# EAGLE design rapidshark-main-breakout-top-mk-1.C (EAGLE 7.5.0)
AUTHOR: sean@yak.net
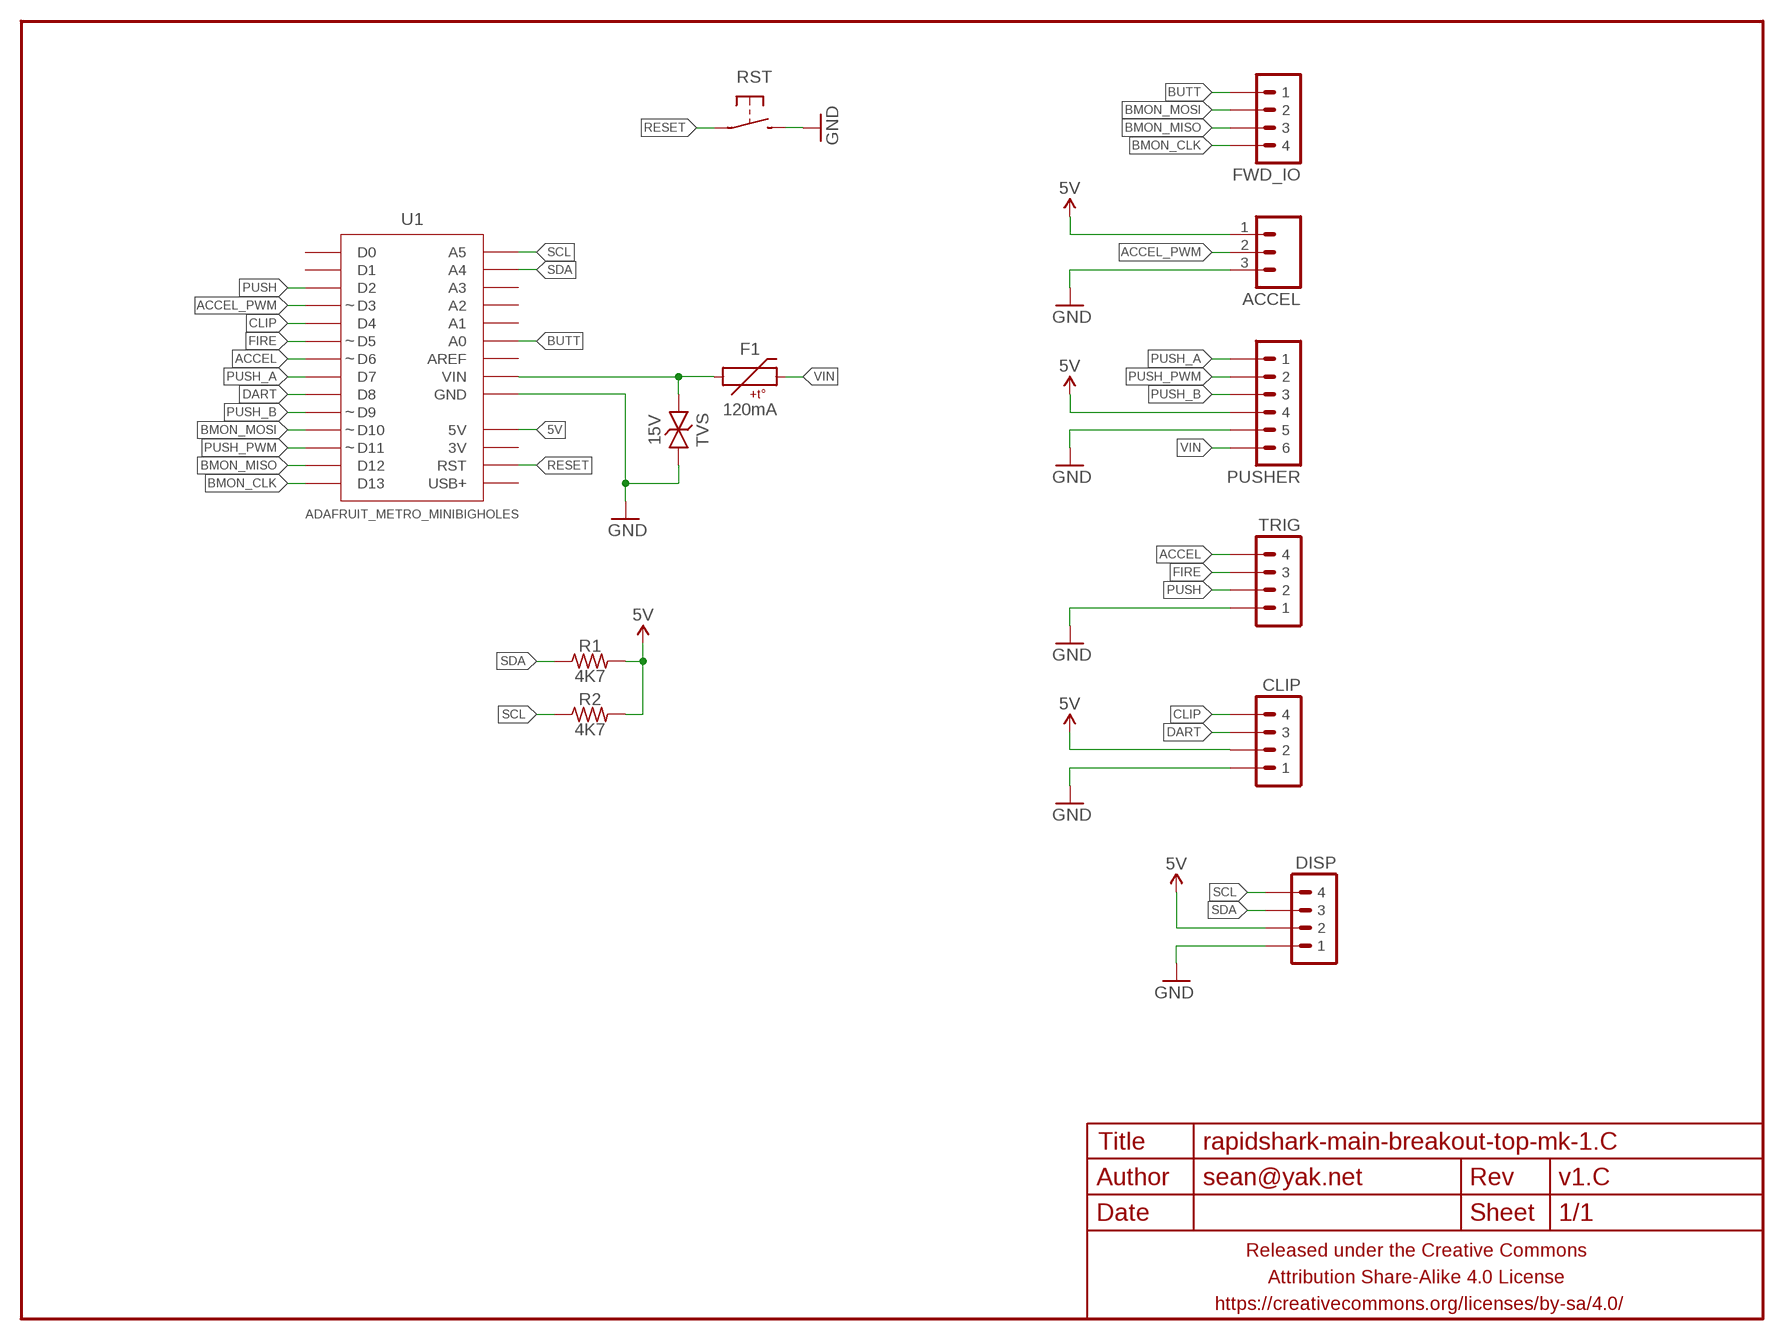
[diagram p0: schematic, sheet 1]

## Parts
ACCEL  M03JST-PTH-VERT-CENTERED  [JST-3-PH-VERT-PTH-CENTERED]
CLIP  M04JST-PTH-VERT  [JST-4-PH-VERT-PTH]
DISP  M04JST-PTH-VERT  [JST-4-PH-VERT-PTH]
F1  120mA  PTCSMD  [PTC-1206]
FRAME1  FRAME-LETTERNO_PACKAGE  [DUMMY]
FWD_IO  M04JST-PTH-VERT  [JST-4-PH-VERT-PTH]
PUSHER  M06JST-PH-PTH-VERT  [JST-6-PH-VERT-PTH]
R1  4K7  RESISTORR0603-TIGHTER  [R0603-TIGHTER]
R2  4K7  RESISTORR0603-TIGHTER  [R0603-TIGHTER]
RST  SPST-NO-TACTCK-PTS840-GK  [TACTILE-SMD-CK-PTS840-GK]
TRIG  M04JST-PTH-VERT  [JST-4-PH-VERT-PTH]
TVS  15V  TVSSMA  [SMA-DIODE-TVS-BIDIR]
U1  ADAFRUIT_METRO_MINIBIGHOLES  [ADAFRUIT_METRO_MINI_BIGHOLES]

## Nets
5V: ACCEL.1 CLIP.2 DISP.2 PUSHER.4 R1.2 R2.2 U1.18(5V)
ACCEL: TRIG.4 U1.7(D6)
ACCEL_PWM: ACCEL.2 U1.4(D3)
BMON_CLK: FWD_IO.4 U1.14(D13)
BMON_MISO: FWD_IO.3 U1.13(D12)
BMON_MOSI: FWD_IO.2 U1.11(D10)
BUTT: FWD_IO.1 U1.23(A0)
CLIP: CLIP.4 U1.5(D4)
DART: CLIP.3 U1.9(D8)
FIRE: TRIG.3 U1.6(D5)
GND: ACCEL.3 CLIP.1 DISP.1 PUSHER.5 RST.3 RST.4 TRIG.1 TVS.1 U1.19(GND) U1.20(GND)
N$1: F1.1 TVS.2 U1.21(VIN)
PUSH: TRIG.2 U1.3(D2)
PUSH_A: PUSHER.1 U1.8(D7)
PUSH_B: PUSHER.3 U1.10(D9)
PUSH_PWM: PUSHER.2 U1.12(D11)
RESET: RST.1 RST.2 U1.16(RST)
SCL: DISP.4 R2.1 U1.28(A5)
SDA: DISP.3 R1.1 U1.27(A4)
VIN: F1.2 PUSHER.6
Unconnected: U1.1(D0) U1.2(D1) U1.15(USB+) U1.17(3V) U1.22(AREF) U1.24(A1) U1.25(A2) U1.26(A3)

## Library data of the parts
ACCEL = a_parts:M03: Header 3 Standard 3-pin 0.1" header. Use with straight break away headers (SKU : PRT-00116), right angle break away headers (PRT-00553), swiss pins (PRT-00743), machine pins (PRT-00117), and female headers (PRT-00115). Molex polarized connector foot print use with SKU : PRT-08232 with associated crimp pins and housings.
CLIP DISP FWD_IO TRIG = a_parts:M04: Header 4 Standard 4-pin 0.1" header. Use with straight break away headers (SKU : PRT-00116), right angle break away headers (PRT-00553), swiss pins (PRT-00743), machine pins (PRT-00117), and female headers (PRT-00115). Molex polarized connector foot print use with SKU : PRT-08231 with associated crimp pins and housings. 1MM SMD Version SKU: PRT-10208
F1 = a_parts:PTC: Resettable Fuse PTC Resettable Fuse. Spark Fun Electronics SKU : COM-08357; PROD_ID: RES-11150
FRAME1 = a_parts:FRAME-LETTER: Schematic Frame Standard 8.5x11 US Letter frame; DESIGNER: sean@yak.net; VERSION: v1.C
PUSHER = a_parts:M06: Header 6 Standard 6-pin 0.1" header. Use with straight break away headers (SKU : PRT-00116), right angle break away headers (PRT-00553), swiss pins (PRT-00743), machine pins (PRT-00117), and female headers (PRT-00115). Molex polarized connector foot print use with SKU : PRT-08094 with associated crimp pins and housings. NOTES ON THE VARIANTS LOCK and LOCK_LONGPADS... This footprint was designed to help hold the alignment of a through-hole component (i.e. 6-pin header) while soldering it into place. You may notice that each hole has been shifted either up or down by 0.005 of an inch from it's more standard position (which is a perfectly straight line). This slight alteration caused the pins (the squares in the middle) to touch the edges of the holes. Because they are alternating, it causes a "brace" to hold the component in place. 0.005 has proven to be the perfect amount of "off-center" position when using our standard breakaway headers. Although looks a little odd when you look at the bare footprint, once you have a header in there, the alteration is very hard to notice. Also,if you push a header all the way into place, it is covered up entirely on the bottom side. This idea of altering the position of holes to aid alignment will be further integrated into the Sparkfun Library for other footprints. It can help hold any component with 3 or more connection pins.
R1 R2 = a_parts:RESISTOR: RESISTOR, American symbol
RST = a_parts:SPST-NO-TACT
TVS = a_parts:TVS: Transient voltage suppressor- prevents ESD on inputs. Ignore package description- MBRA140 is NOT this type of part!!!
U1 = a_parts:ADAFRUIT_METRO_MINI

## Board
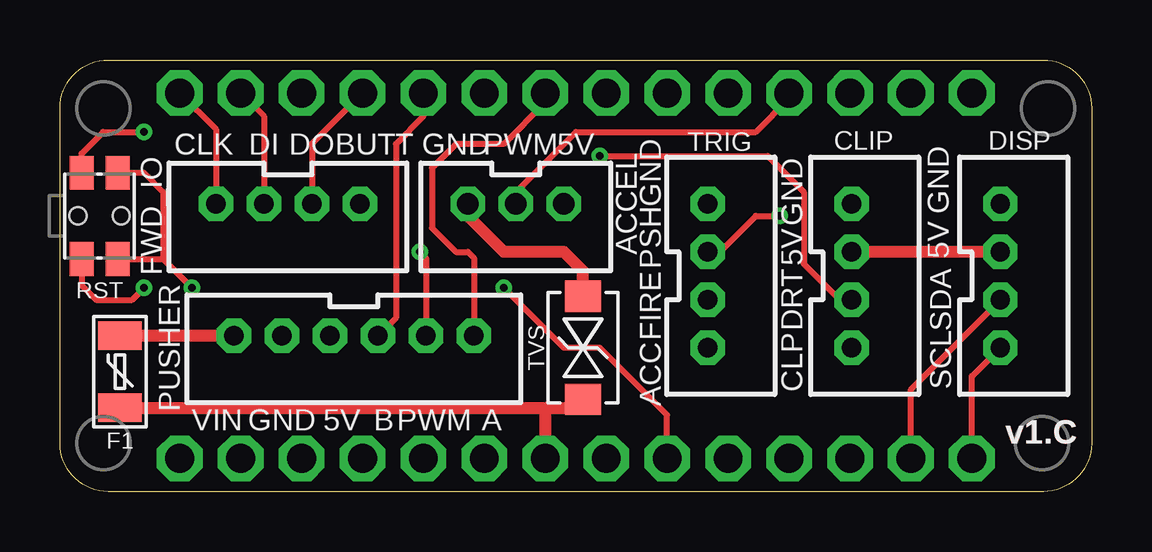
[diagram p1: board, top side]
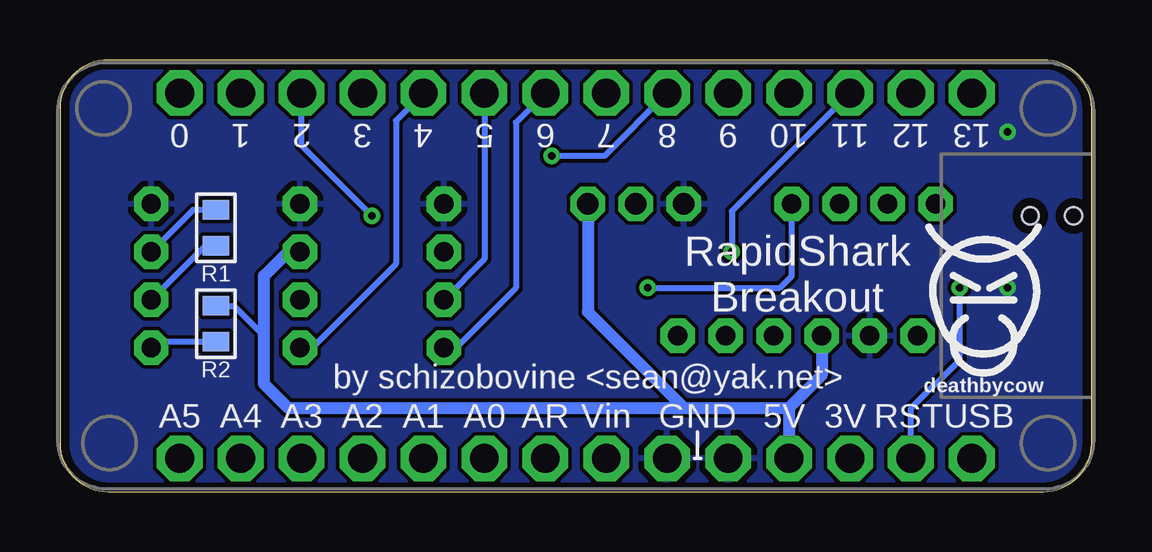
[diagram p2: board, bottom side, seen from below]

Size 43 x 18 mm. Coordinates in mm from the lower left corner, seen from the top.
Outline: 2,18 41,18 arc-90 43,16 43,2 arc-90 41,0 2,0 arc-90 0,2 0,16 arc-90 2,18
Copper layers (1*16): Top 0.0356mm / dielectric 1.5011mm / Bottom 0.0356mm
Design rules "LaenPCBOrder_2": minimum track width 6mil, minimum drill 13mil, track to track 6mil, track to pad 6mil, pad to pad 6mil, via to via 6mil, smd to smd 6mil, copper to edge 15mil, drill to drill 6mil, minimum pad ring 7mil, minimum via ring 7mil, stop-mask expansion 3mil, vias tented up to drill 20mil, thermal gap 10mil

### Footprints (pad centres in the part's own frame; a part is rotated, then mirrored left to right if it is on the bottom)
JST-3-PH-VERT-PTH-CENTERED = drill 0.9 pad 1.422 octagon: 1 -2,0; 2 0,0; 3 2,0
JST-4-PH-VERT-PTH = drill 0.8 pad 1.422 octagon: 1 0,0; 2 2,0; 3 4,0; 4 6,0
PTC-1206 = smd 1.2 x 1.8: 1 -1.5,0; 2 1.5,0
JST-6-PH-VERT-PTH = drill 0.8 pad 1.422 octagon: 1 -5,0; 2 -3,0; 3 -1,0; 4 1,0; 5 3,0; 6 5,0
R0603-TIGHTER = smd 0.8 x 1.1: 1 -0.75,0; 2 0.75,0
TACTILE-SMD-CK-PTS840-GK = smd 1.4 x 1: 1 -1.8,0.75; 2 1.8,0.75; 3 -1.8,-0.75; 4 1.8,-0.75 | hole 0.7: 0,-0.9; 0,0.9
SMA-DIODE-TVS-BIDIR = smd 1.3 x 1.5: 1 -2.15,0; 2 2.15,0
ADAFRUIT_METRO_MINI_BIGHOLES = drill 1.2 pad 1.9 octagon: 1 16.51,7.62; 2 13.97,7.62; 3 11.43,7.62; 4 8.89,7.62; 5 6.35,7.62; 6 3.81,7.62; 7 1.27,7.62; 8 -1.27,7.62; 9 -3.81,7.62; 10 -6.35,7.62; 11 -8.89,7.62; 12 -11.43,7.62; 13 -13.97,7.62; 14 -16.51,7.62; 15 -16.51,-7.62; 16 -13.97,-7.62; 17 -11.43,-7.62; 18 -8.89,-7.62; 19 -6.35,-7.62; 20 -3.81,-7.62; 21 -1.27,-7.62; 22 1.27,-7.62; 23 3.81,-7.62; 24 6.35,-7.62; 25 8.89,-7.62; 26 11.43,-7.62; 27 13.97,-7.62; 28 16.51,-7.62

### Placement (x,y rotation side)
ACCEL  19,12 180 top
CLIP  33,12 270 top
DISP  39.2,12 270 top
F1  2.5,5 90 top
FRAME1  0,0 270 bottom
FWD_IO  12.5,12 180 top
PUSHER  12.25,6.5 180 top
R1  36.5,11 90 bottom
R2  36.5,7 90 bottom
RST  1.65,11.5 270 top
TRIG  27,12 270 top
TVS  21.8,6 270 top
U1  21.5,9 0 top
U$2  [COW_SMALL]  4.5,8.5 0 bottom

### Tracks (layer width: path | path; a pad name or v marks a point on that pad's centre or on a via)
5V
  Top 0.5: DISP.2 CLIP.2
  Bottom 0.254: R1.2 37.45,11.75 DISP.2 | R2.2 35.75,7.75 34.5,6.5
  Bottom 0.5: 17,3.5 33.5,3.5 34.5,4.5 34.5,6.5 34.5,9 33.5,10 CLIP.2 | 17,3.5 12.61,3.5 | 12.61,3.5 U1.18 | PUSHER.4 11.25,4.86 12.61,3.5 | ACCEL.1 21,7.5 17,3.5
ACCEL
  Bottom 0.254: U1.7 24,15.39 24,8.5 26.5,6 TRIG.4
ACCEL_PWM
  Top 0.254: ACCEL.2 19,12.5 21.5,15 29,15 30.39,16.39 U1.4
BMON_CLK
  Top 0.254: U1.14 6.5,15.11 FWD_IO.4
BMON_MISO
  Top 0.254: U1.13 8.5,15.65 FWD_IO.3
BMON_MOSI
  Top 0.254: U1.11 10.5,14.51 FWD_IO.2
BUTT  (via drill 0.33)
  Top 0.254: U1.23 25.31,3.19 22.5,6 21,6 v18.5,8.5
  Bottom 0.254: v18.5,8.5 13,8.5 12.5,9 FWD_IO.1
CLIP
  Bottom 0.254: U1.5 29,15.47 29,9.5 32.5,6 CLIP.4
DART  (via drill 0.33)
  Top 0.254: v22.5,14 29.5,14 31,12.5 31,9.5 32.5,8 CLIP.3
  Bottom 0.254: U1.9 20.31,14 v22.5,14
FIRE
  Bottom 0.254: U1.6 25.31,9.69 TRIG.3
GND  (via drill 0.33)
  Top 0.254: RST.3 0.9,14.1 1.8,15 v3.5,15 | RST.4 0.9,8.6 1.5,8 3,8 v3.5,8.5
  Top 0.5: ACCEL.3 17,11.5 18.5,10 21,10 21.8,9.2 TVS.1
  pour Bottom (rank 6): 2,18 41,18 arc-90 43,16 43,2 arc-90 41,0 2,0 arc-90 0,2 0,16 arc-90
N$1
  Top 0.5: F1.1 20.3,3.5 | 20.3,3.5 21.45,3.5 TVS.2 | U1.21 20.23,3.43 20.3,3.5
PUSH  (via drill 0.33)
  Top 0.254: TRIG.2 27.5,10 29,11.5 v30,11.5
  Bottom 0.254: v30,11.5 32.93,14.43 U1.3
PUSH_A
  Top 0.254: U1.8 20.23,16.23 18.5,14.5 16.5,14.5 15.5,13.5 15.5,11 16.5,10 17,10 17.25,9.75 PUSHER.1
PUSH_B
  Top 0.254: U1.10 15.15,15.65 14,14.5 14,7.25 PUSHER.3
PUSH_PWM  (via drill 0.33)
  Top 0.254: v15,10 15.25,9.75 PUSHER.2
  Bottom 0.254: U1.12 15,11.69 v15,10
RESET  (via drill 0.33)
  Top 0.254: 4.3,9.7 v5.5,8.5 | RST.2 4.3,9.7 | RST.1 3.5,13.3 4.3,12.5 4.3,9.7
  Bottom 0.254: U1.16 7.53,3.47 5.5,5.5 v5.5,8.5
SCL
  Top 0.254: U1.28 38.01,4.81 DISP.4
  Bottom 0.254: R2.1 38.95,6.25 DISP.4
SDA
  Top 0.254: U1.27 35.47,4.27 DISP.3
  Bottom 0.254: R1.1 36.95,10.25 DISP.3
VIN
  Top 0.5: PUSHER.6 F1.2

### Text on the board
tPlace: CLK | DI | DO | BUTT | GND | PWM | 5V | GND | GND | GND | PSH | 5V | 5V | FIRE | DRT | SDA | SCL | ACC | CLP | VIN | GND | 5V | B | PWM | A
bPlace: RapidShark / Breakout | by schizobovine <sean@yak.net>